# Altium project smartTarget.PrjPcb
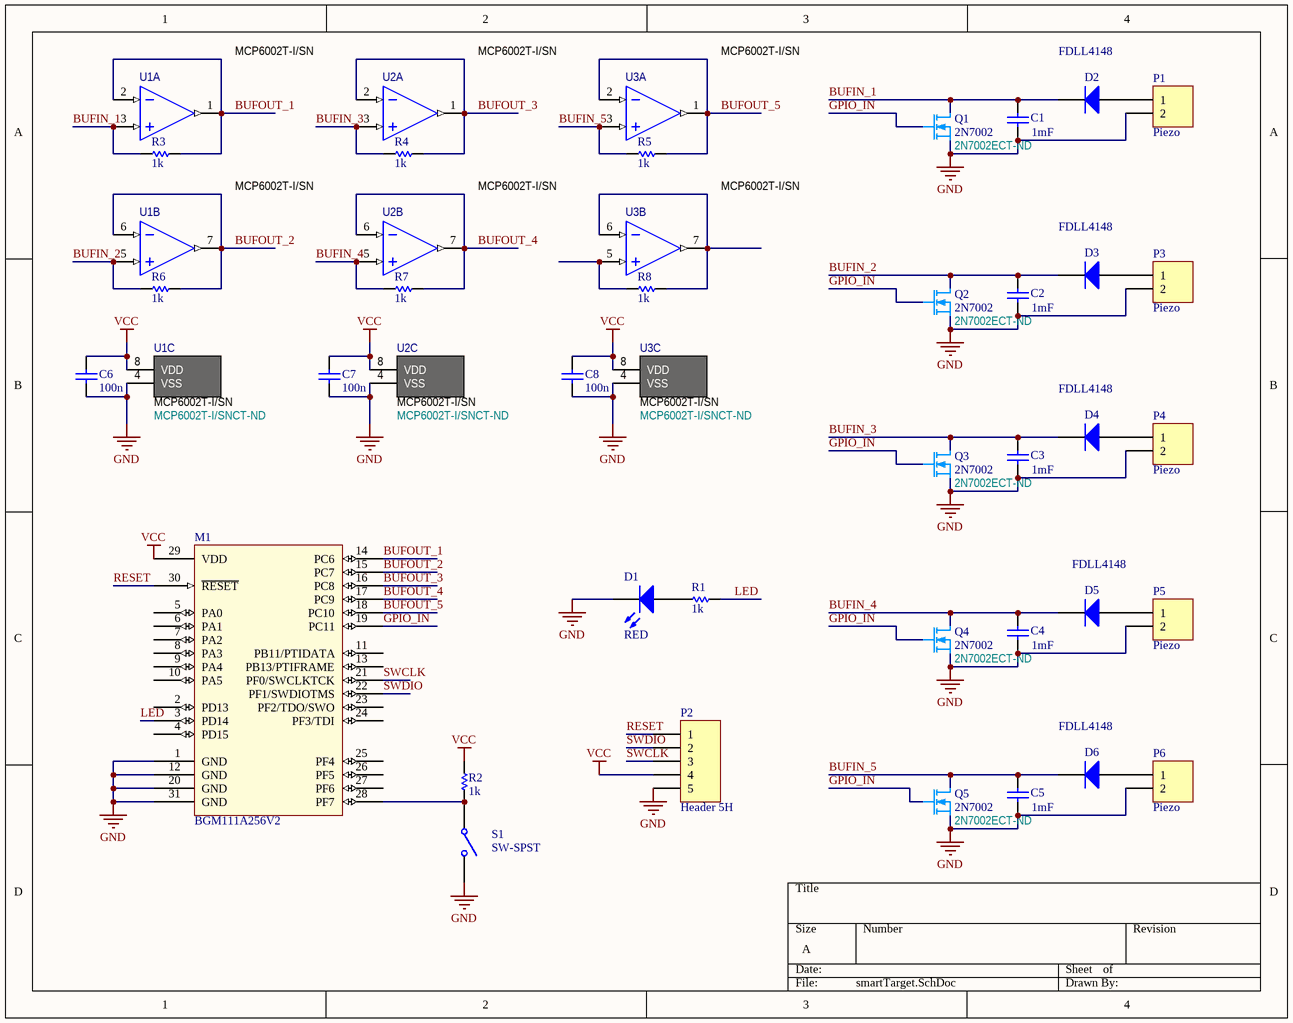
[diagram p0: smartTarget.SchDoc]
1 sheet, 38 parts. Net scope: global (net labels, ports and power ports of the same name join across sheets).
Board file: smartTarget.PcbDoc

## Sheet smartTarget.SchDoc
size A

### Parts
C1  1mF  [CAPC1608N]
C2  1mF  [CAPC1608N]
C3  1mF  [CAPC1608N]
C4  1mF  [CAPC1608N]
C5  1mF  [CAPC1608N]
C6  100n  [CAPC1608N]
C7  100n  [CAPC1608N]
C8  100n  [CAPC1608N]
D1  RED  [LTST-C190EKT]
D2  FDLL4148  [FAIR-LL-34_V]
D3  FDLL4148  [FAIR-LL-34_V]
D4  FDLL4148  [FAIR-LL-34_V]
D5  FDLL4148  [FAIR-LL-34_V]
D6  FDLL4148  [FAIR-LL-34_V]
M1  BGM111A256V2  [BGM111A]
P1  Piezo  [HDR1X2]
P2  Header 5H  [HDR1X5H]
P3  Piezo  [HDR1X2]
P4  Piezo  [HDR1X2]
P5  Piezo  [HDR1X2]
P6  Piezo  [HDR1X2]
Q1  2N7002  Supplier Part Number 1: 2N7002ECT-ND  [SOT23-3N]
Q2  2N7002  Supplier Part Number 1: 2N7002ECT-ND  [SOT23-3N]
Q3  2N7002  Supplier Part Number 1: 2N7002ECT-ND  [SOT23-3N]
Q4  2N7002  Supplier Part Number 1: 2N7002ECT-ND  [SOT23-3N]
Q5  2N7002  Supplier Part Number 1: 2N7002ECT-ND  [SOT23-3N]
R1  1k  [RESC1608N]
R2  1k  [RESC1608N]
R3  1k  [RESC1608N]
R4  1k  [RESC1608N]
R5  1k  [RESC1608N]
R6  1k  [RESC1608N]
R7  1k  [RESC1608N]
R8  1k  [RESC1608N]
S1  SW-SPST  [SPST-2]
U1  MCP6002T-I/SN  [SOIC127P600-8N]  (parts A,B,C of 3)
U2  MCP6002T-I/SN  [SOIC127P600-8N]  (parts A,B,C of 3)
U3  MCP6002T-I/SN  [SOIC127P600-8N]  (parts A,B,C of 3)

### Nets
GND: C1.1 C2.1 C3.1 C4.1 C5.1 C6.2 C7.2 C8.2 D1.2(K) M1.1(GND) M1.12(GND) M1.20(GND) M1.31(GND) P1.2 P2.5 P3.2 P4.2 P5.2 P6.2 Q1.2(S) Q2.2(S) Q3.2(S) Q4.2(S) Q5.2(S) S1.2(NO) U1.4(VSS) U2.4(VSS) U3.4(VSS)
VCC: C6.1 C7.1 C8.1 M1.29(VDD) P2.4 R2.2 U1.8(VDD) U2.8(VDD) U3.8(VDD)
BUFIN_1: C1.2 D2.1(K) Q1.3(D) R3.1 U1.3(IN+)
BUFIN_2: C2.2 D3.1(K) Q2.3(D) R6.1 U1.5(IN+)
BUFIN_3: C3.2 D4.1(K) Q3.3(D) R4.1 U2.3(IN+)
BUFIN_4: C4.2 D5.1(K) Q4.3(D) R7.1 U2.5(IN+)
BUFIN_5: C5.2 D6.1(K) Q5.3(D) R5.1 U3.3(IN+)
BUFOUT_1: M1.14(PC6) R3.2 U1.1(OUT) U1.2(IN-)
BUFOUT_2: M1.15(PC7) R6.2 U1.6(IN-) U1.7(OUT)
BUFOUT_3: M1.16(PC8) R4.2 U2.1(OUT) U2.2(IN-)
BUFOUT_4: M1.17(PC9) R7.2 U2.6(IN-) U2.7(OUT)
BUFOUT_5: M1.18(PC10) R5.2 U3.1(OUT) U3.2(IN-)
GPIO_IN: M1.19(PC11) Q1.1(G) Q2.1(G) Q3.1(G) Q4.1(G) Q5.1(G)
LED: M1.3(PD14) R1.2
RESET: M1.30(~{RESET}) P2.1
SWCLK: M1.21(PF0/SWCLKTCK) P2.3
SWDIO: M1.22(PF1/SWDIOTMS) P2.2
NetD1_1: D1.1(A) R1.1
NetD2_2: D2.2(A) P1.1
NetD3_2: D3.2(A) P3.1
NetD4_2: D4.2(A) P4.1
NetD5_2: D5.2(A) P5.1
NetD6_2: D6.2(A) P6.1
NetM1_28: M1.28(PF7) R2.1 S1.1(COMMON)
NetR8_1: R8.1 U3.5(IN+)
NetR8_2: R8.2 U3.6(IN-) U3.7(OUT)

Not connected (* = marked no-connect by the designer): M1 2(PD13) 4(PD15) 5(PA0) 6(PA1) 7(PA2) 8(PA3) 9(PA4) 10(PA5) 11(PB11/PTIDATA) 13(PB13/PTIFRAME) 23(PF2/TDO/SWO) 24(PF3/TDI) 25(PF4) 26(PF5) 27(PF6)

### Library data of the parts
C1-C8 = Cap Semi: Capacitor (Semiconductor SIM Model); Published: 8-Jun-2000; LatestRevisionDate: 29-May-2009; LatestRevisionNote: IPC-7351 Footprint Added.; PackageReference: C1206; Publisher: Altium Limited; PackageDescription: Chip Capacitor
D1 = LED_RED: Typical RED GaAs LED; Published: 8-Jun-2000; LatestRevisionDate: 08-Jul-2005; LatestRevisionNote: Mech Layer 1 removed.; PackageReference: LED-1; Publisher: Altium Limited; PackageDescription: LED; 2 Leads
D2-D6 = CMP-2000-05112-1: High Conductance Fast Diode, 500 mW, 100 V, -65 to 175 degC, 2-Pin SMD, RoHS, Tape and Reel; Manufacturer: FairchildSemiconductor; Peak Reverse Repetitive Voltage: 100V; Configuration: Single; Peak Forward Voltage: 1@0.01AV; Peak Reverse Current: 5@75VuA; Rad Hard: No; Peak Non-Repetitive Surge Current: 4A; Peak Reverse Recovery Time: 4ns; Type: SmallSignalSwitchingDiode; Peak Average Forward Current: 0.3A; Datasheet URL: https://datasheet.ciiva.com/8053/30071-8053638.pdf; Mounting: SurfaceMount; Package: 2LL-34; Operating Temperature: -65to175degC; Category: Rectifier; Packaging: Tape&Reel; Package URL: https://www.fairchildsemi.com/package-drawings/SO/SOD80A.pdf; Package Description: 2-Leads SOD, Body 3.6x1.5mm; Manufacturer URL: https://www.fairchildsemi.com/; Datasheet Version: Nov-96
M1 = BGM111A256V2: Blue Gecko Bluetooth 4.1 Module with integrated antenna, 256KB Flash, 32KBRAM; Manufacturer: Silicon Labs; Supplier 1: Digi-Key; Supplier Part Number 1: BGM111A256V2; Manufacturer Part Number: BGM111A256V2
P1 P3-P6 = Header 2: Header, 2-Pin; LatestRevisionDate: 17-Jul-2002; LatestRevisionNote: Re-released for DXP Platform.; Publisher: Altium Limited
P2 = Header 5H: Header, 5-Pin, Right Angle; LatestRevisionDate: 17-Jul-2002; LatestRevisionNote: Re-released for DXP Platform.; Publisher: Altium Limited
Q1-Q5 = MOSFET-2N7002: 2N7002 300mA 60V; Published: 8-Jun-2000; LatestRevisionDate: 17-Jul-2002; LatestRevisionNote: Re-released for DXP Platform.; PackageVersion: 1995/1996; PackageReference: E3; Publisher: Altium Limited; PackageDescription: TO, Flat Index; 3 In-Line, Axial Leads; Body Dia. 4.6mm; Lead Dia. 0.5 mm (max); Supplier 1: Digi-Key
R1-R8 = Res Semi: Semiconductor Resistor; Published: 8-Jun-2000; LatestRevisionDate: 17-Jul-2002; LatestRevisionNote: Re-released for DXP Platform.; PackageReference: AXIAL-0.5; Publisher: Altium Limited; PackageDescription: Axial Device, Thru-Hole; 2 Leads; 0.5 in Pin Spacing
S1 = SW-SPST: Single-Pole, Single-Throw Switch; Published: 24-Mar-1999; LatestRevisionDate: 17-Jul-2002; LatestRevisionNote: Re-released for DXP Platform.; PackageReference: SPST-2; Publisher: Altium Limited; PackageDescription: Switch; 2 Leads
U1-U3 = MCP6002T-I/SN: IC OPAMP GP 1MHZ RRO 8SOIC; Manufacturer: Microchip Technology; Amplifier Type: General Purpose; Number of Circuits: 2; Output Type: Rail-to-Rail; Slew Rate: 0.6 V/µs; Current - Input Bias: 1pA; Voltage - Input Offset: 4.5mV; Current - Supply: 100µA; Current - Output / Channel: 23mA; Voltage - Supply, Single/Dual (±): 1.8 V ~ 6 V; Supplier 1: Digi-Key; Manufacturer Part Number: MCP6002T-I/SN; RoHS: RoHS Compliant; Category: Integrated Circuits (ICs); Stock 1: 57519; Pricing 1: 1=0.33, 25=0.28, 100=0.25 (USD); Packaging: Cut Tape (CT); Part Status: Active; Gain Bandwidth Product: 1MHz; -3db Bandwidth: -; Operating Temperature: -40°C ~ 85°C; Mounting Type: Surface Mount; Package / Case: 8-SOIC (0.154", 3.90mm Width); Supplier Device Package: 8-SOIC; ComponentLink1URL: http://www.microchip.com/mymicrochip/filehandler.aspx?ddocname=en011705; ComponentLink1Description: http://www.microchip.com/mymicrochip/filehandler.aspx?ddocname=en011705